# EAGLE design OSO-MISC-20-026 Ring-Cap Adapter (EAGLE 9.6.2)
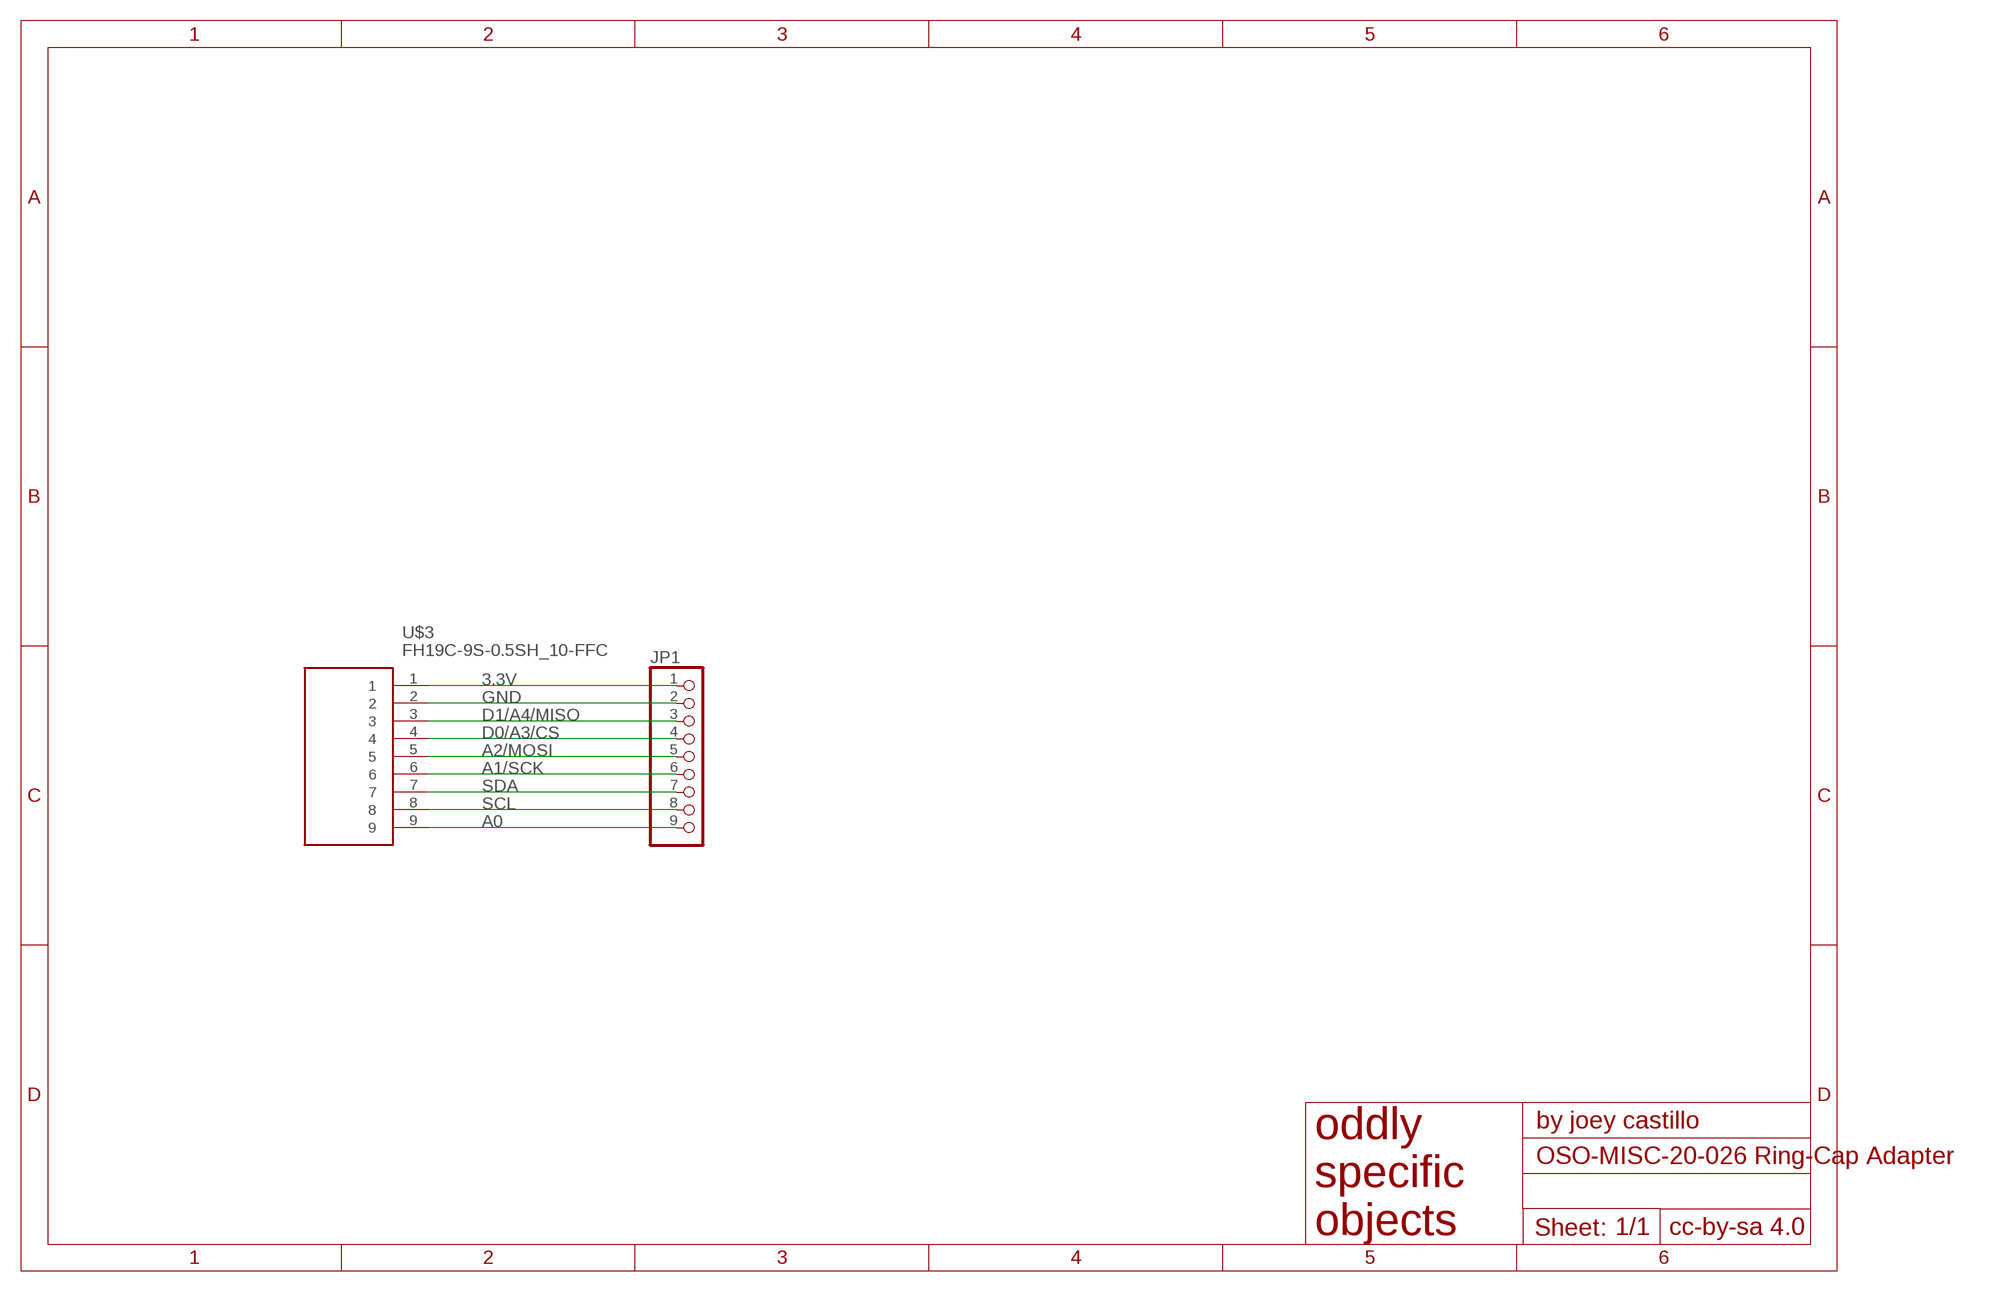
[diagram p0: schematic, sheet 1]

## Parts
JP1  HEADER-1X9_JSTSH  [JST_SH9]
U$3  FH19C-9S-0.5SH_10-FFC  [FH19C9S05SH10-FFC]

## Nets
3.3V: JP1.1 U$3.1
A0: JP1.9 U$3.9
A1/SCK: JP1.6 U$3.6
A2/MOSI: JP1.5 U$3.5
D0/A3/CS: JP1.4 U$3.4
D1/A4/MISO: JP1.3 U$3.3
GND: JP1.2 U$3.2
SCL: JP1.8 U$3.8
SDA: JP1.7 U$3.7

## Library data of the parts
JP1 = My Stuff:HEADER-1X9: PIN HEADER
U$3 = FH19C-9S-0.5SH:FH19C-9S-0.5SH_10-FFC

## Net classes
1 power: width 0.305 mm

## Board
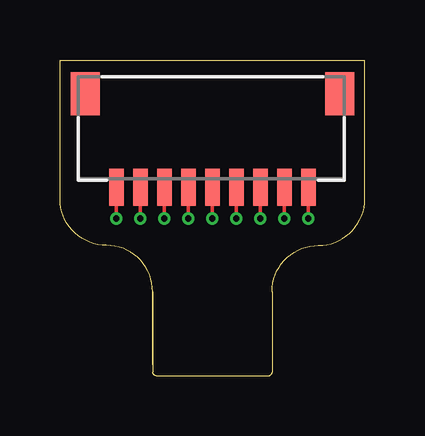
[diagram p1: board, top side]
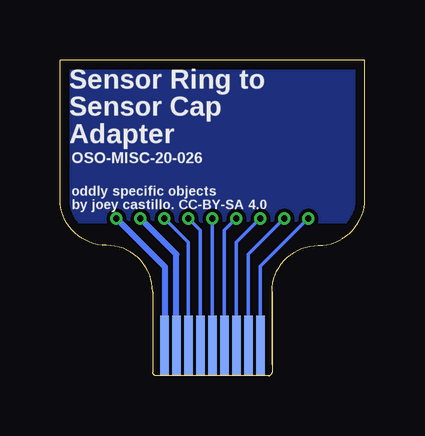
[diagram p2: board, bottom side, seen from below]

Size 12.7 x 13.15 mm. Coordinates in mm from the lower left corner, seen from the top.
Outline: 3.86,0.45 3.86,3.5 arc90 1.93,5.43 arc-90 0,7.36 0,13.15 12.7,13.15 12.7,7.36 arc-90 10.77,5.43 arc90 8.84,3.5
Copper layers (1*16): Top 0.035559375mm / dielectric 1.6mm / Bottom 0.035559375mm
Design rules "oshpark-2layer *": minimum track width 6mil, minimum drill 10mil, track to track 6mil, track to pad 6mil, pad to pad 6mil, via to via 6mil, smd to smd 6mil, copper to edge 15mil, drill to drill 6mil, minimum pad ring 5mil, minimum via ring 5mil, stop-mask expansion 2.5mil, vias tented up to drill 12mil, thermal gap 10mil

### Footprints (pad centres in the part's own frame; a part is rotated, then mirrored left to right if it is on the bottom)
JST_SH9 = smd 0.6 x 1.55: 1 -4,2.514; 2 -3,2.514; 3 -2,2.514; 4 -1,2.514; 5 0,2.514; 6 1,2.514; 7 2,2.514; 8 3,2.514; 9 4,2.514 | smd 1.2 x 1.8: MT1 -5.3,-1.386; MT2 5.3,-1.386
FH19C9S05SH10-FFC = smd 0.347 x 2.5 bottom: 1 2,-2.25; 2 1.5,-2.25; 3 1,-2.25; 4 0.5,-2.25; 5 0,-2.25; 6 -0.5,-2.25; 7 -1,-2.25; 8 -1.5,-2.25; 9 -2,-2.25

### Placement (x,y rotation side)
JP1  6.35,10.36 180 top
U$3  6.35,3.5 0 top

### Tracks (layer width: path | path; a pad name or v marks a point on that pad's centre or on a via)
3.3V  (via drill 0.25)
  Top 0.152: JP1.1 v10.35,6.55
  Bottom 0.203: U$3.1 8.33,1.27 8.33,1.47
  Bottom 0.254: v10.35,6.55 8.33,4.53 8.33,1.47
A0  (via drill 0.25)
  Top 0.152: JP1.9 v2.35,6.55
  Bottom 0.152: v2.35,6.55 4.35,4.55 U$3.9
A1/SCK  (via drill 0.25)
  Top 0.152: JP1.6 v5.35,6.55
  Bottom 0.152: U$3.6 5.85,6.05 v5.35,6.55
A2/MOSI  (via drill 0.25)
  Top 0.152: JP1.5 v6.35,6.55
  Bottom 0.152: U$3.5 v6.35,6.55
D0/A3/CS  (via drill 0.25)
  Top 0.152: JP1.4 v7.35,6.55
  Bottom 0.152: U$3.4 6.85,6.05 v7.35,6.55
D1/A4/MISO  (via drill 0.25)
  Top 0.152: JP1.3 v8.35,6.55
  Bottom 0.152: U$3.3 7.35,5.55 v8.35,6.55
GND  (via drill 0.25)
  Top 0.152: JP1.2 v9.35,6.55
  Bottom 0.254: U$3.2 7.85,5.05 v9.35,6.55
N$1
  pour Bottom: 0,13.15 12.7,13.15 12.7,6.42 0,6.42
SCL  (via drill 0.25)
  Top 0.152: JP1.8 v3.35,6.55
  Bottom 0.152: U$3.8 4.85,5.05 v3.35,6.55
SDA  (via drill 0.25)
  Top 0.152: JP1.7 v4.35,6.55
  Bottom 0.152: U$3.7 5.35,5.55 v4.35,6.55

### Text on the board
bPlace: Sensor Ring to / Sensor Cap / Adapter | OSO-MISC-20-026 | oddly specific objects / by joey castillo. CC-BY-SA 4.0